# EAGLE schematic Bajutsu (EAGLE 6.1)
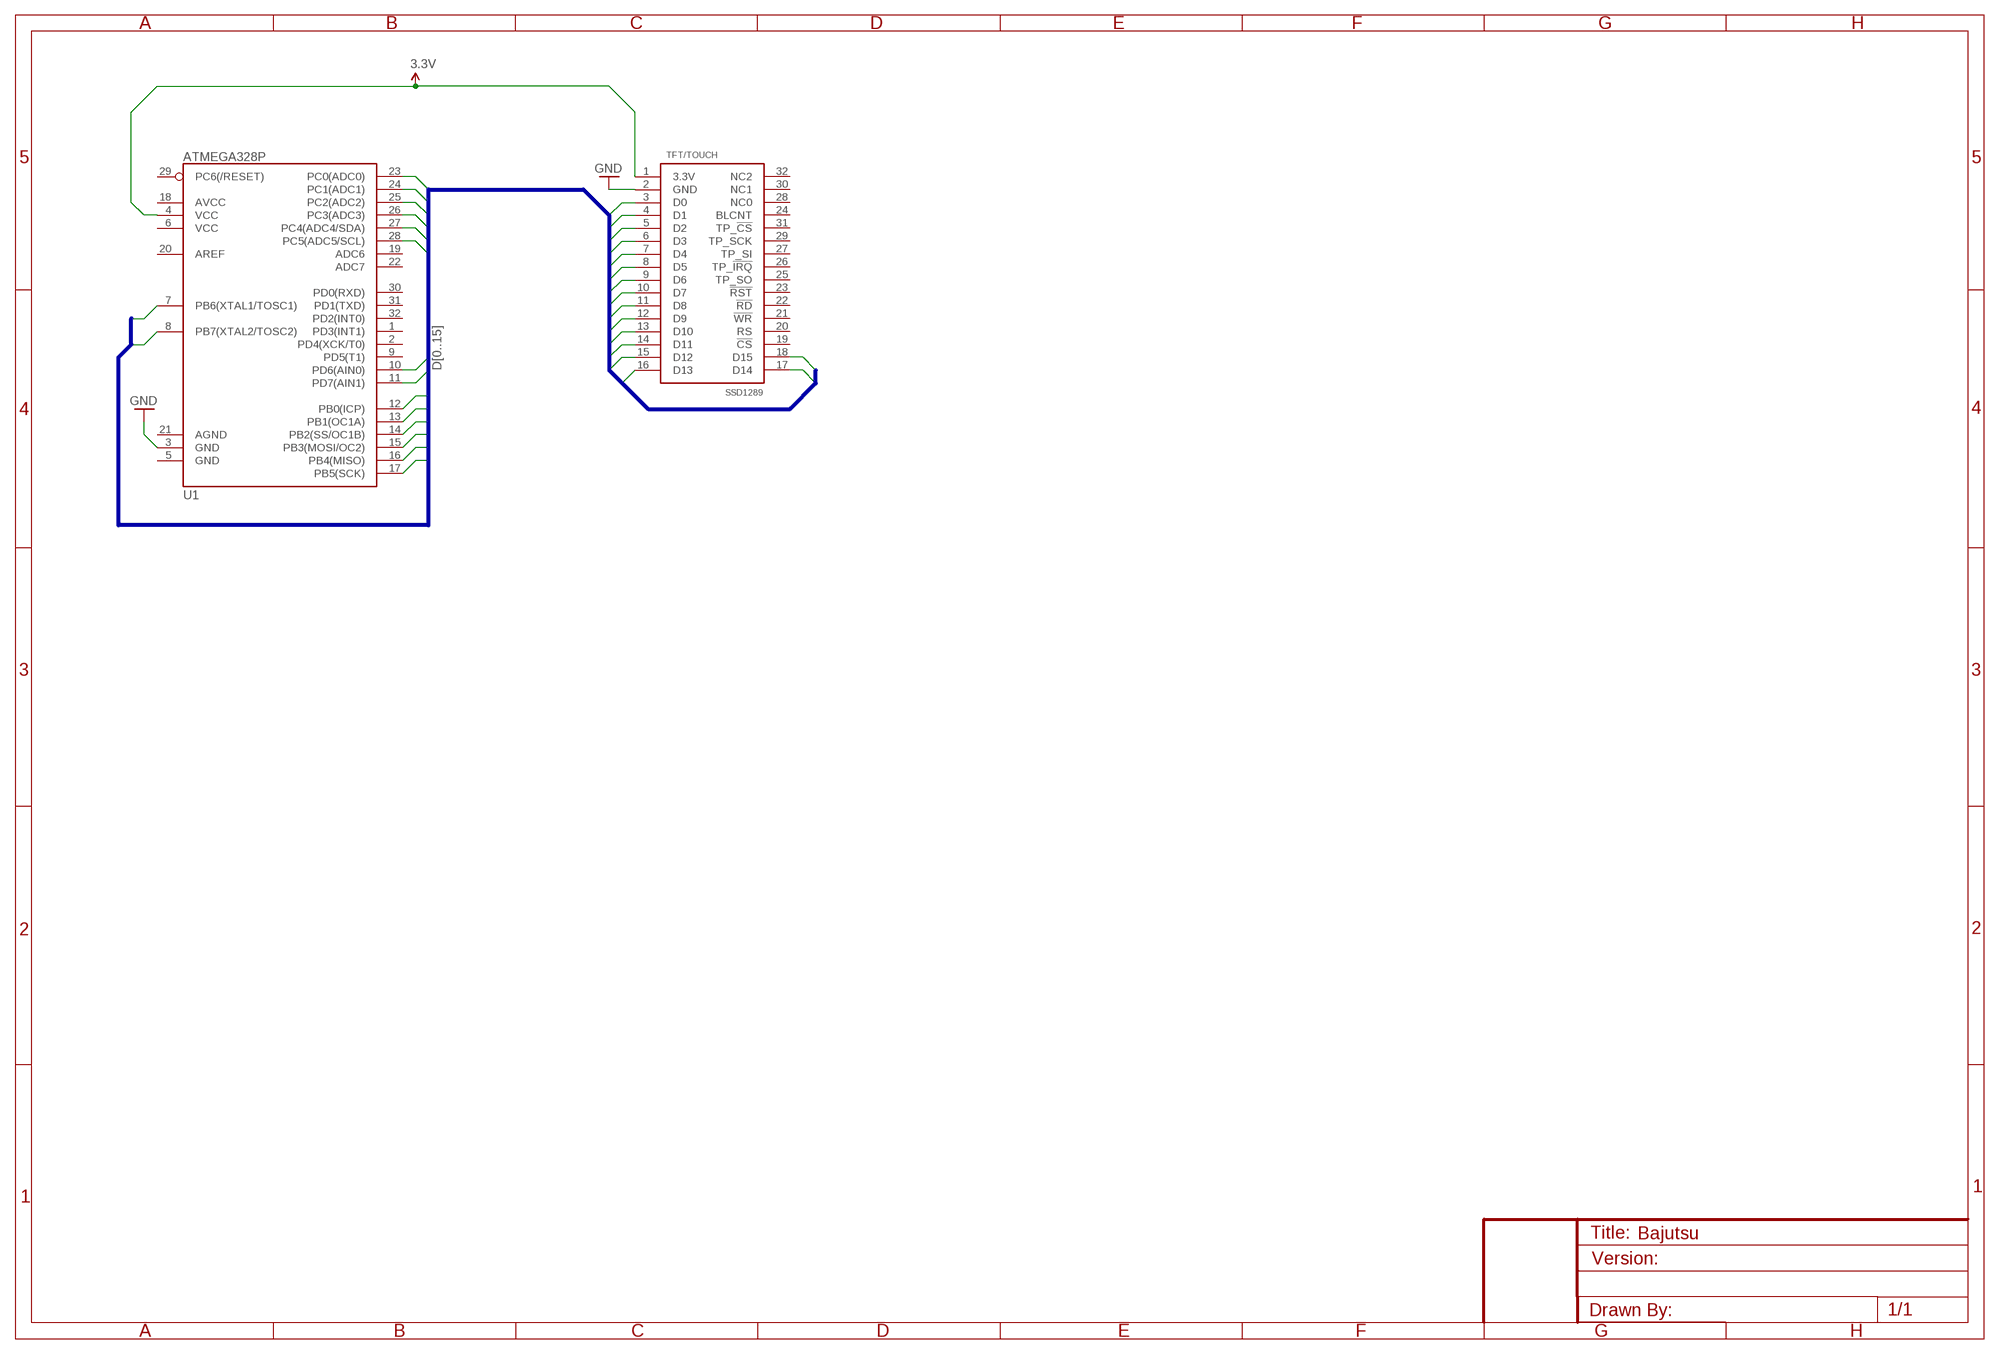
[diagram p0: schematic, sheet 1]

## Parts
TFT/TOUCH  SSD1289  [2X16]
U1  ATMEGA328P  ATMEGA328_SMT  [TQFP32-08]

## Nets
3.3V: TFT/TOUCH.1(3.3V) U1.4(VCC)
D0: TFT/TOUCH.3(D0) U1.12(PB0(ICP))
D1: TFT/TOUCH.4(D1) U1.13(PB1(OC1A))
D2: TFT/TOUCH.5(D2) U1.14(PB2(SS/OC1B))
D3: TFT/TOUCH.6(D3) U1.15(PB3(MOSI/OC2))
D4: TFT/TOUCH.7(D4) U1.16(PB4(MISO))
D5: TFT/TOUCH.8(D5) U1.17(PB5(SCK))
D6: TFT/TOUCH.9(D6) U1.7(PB6(XTAL1/TOSC1))
D7: TFT/TOUCH.10(D7)
D8: TFT/TOUCH.11(D8) U1.8(PB7(XTAL2/TOSC2)) U1.23(PC0(ADC0))
D9: TFT/TOUCH.12(D9) U1.24(PC1(ADC1))
D10: TFT/TOUCH.13(D10) U1.25(PC2(ADC2))
D11: TFT/TOUCH.14(D11) U1.26(PC3(ADC3))
D12: TFT/TOUCH.15(D12) U1.27(PC4(ADC4/SDA))
D13: TFT/TOUCH.16(D13) U1.28(PC5(ADC5/SCL))
D14: TFT/TOUCH.17(D14) U1.10(PD6(AIN0)) U1.11(PD7(AIN1))
D15: TFT/TOUCH.18(D15)
GND: TFT/TOUCH.2(GND) U1.3(GND)
Unconnected: TFT/TOUCH.19(!CS) TFT/TOUCH.20(RS) TFT/TOUCH.21(!WR) TFT/TOUCH.22(!RD) TFT/TOUCH.23(!RST) TFT/TOUCH.24(BLCNT) TFT/TOUCH.25(TP_SO) TFT/TOUCH.26(TP_!IRQ) TFT/TOUCH.27(TP_SI) TFT/TOUCH.28(NC0) TFT/TOUCH.29(TP_SCK) TFT/TOUCH.30(NC1) TFT/TOUCH.31(TP_!CS) TFT/TOUCH.32(NC2) U1.1(PD3(INT1)) U1.2(PD4(XCK/T0)) U1.5(GND) U1.6(VCC) U1.9(PD5(T1)) U1.18(AVCC) U1.19(ADC6) U1.20(AREF) U1.21(AGND) U1.22(ADC7) U1.29(PC6(/RESET)) U1.30(PD0(RXD)) U1.31(PD1(TXD)) U1.32(PD2(INT0))

## Buses
D[0..15]

## Library data of the parts
TFT/TOUCH = Barnard:SSD1289: 240x320 RGB TFT controller with SPI touch controller. Commonly found on Asian TFT modules such as HY32D.
U1 = SparkFun-DigitalIC:ATMEGA328_SMT: 32-Pin Atmega328 part Commonly used on Arduino compatible boards Available in QFP and QFN packages TQFP is IC-09069 QFN is non-stock; PROD_ID: IC-09069